# EasyEDA Pro project Dual_Motor_Driver_V3.1.eprj, schematic Motor_Driver
Create Date: 2025-08-30; Page Name: P1; Project Name: Dual_Motor_Driver_V3.1; Schematic Name: Motor_Driver; Update Date: 2025-08-30; Company: 嘉立创EDA; Page Size: A4; Version: V1.0
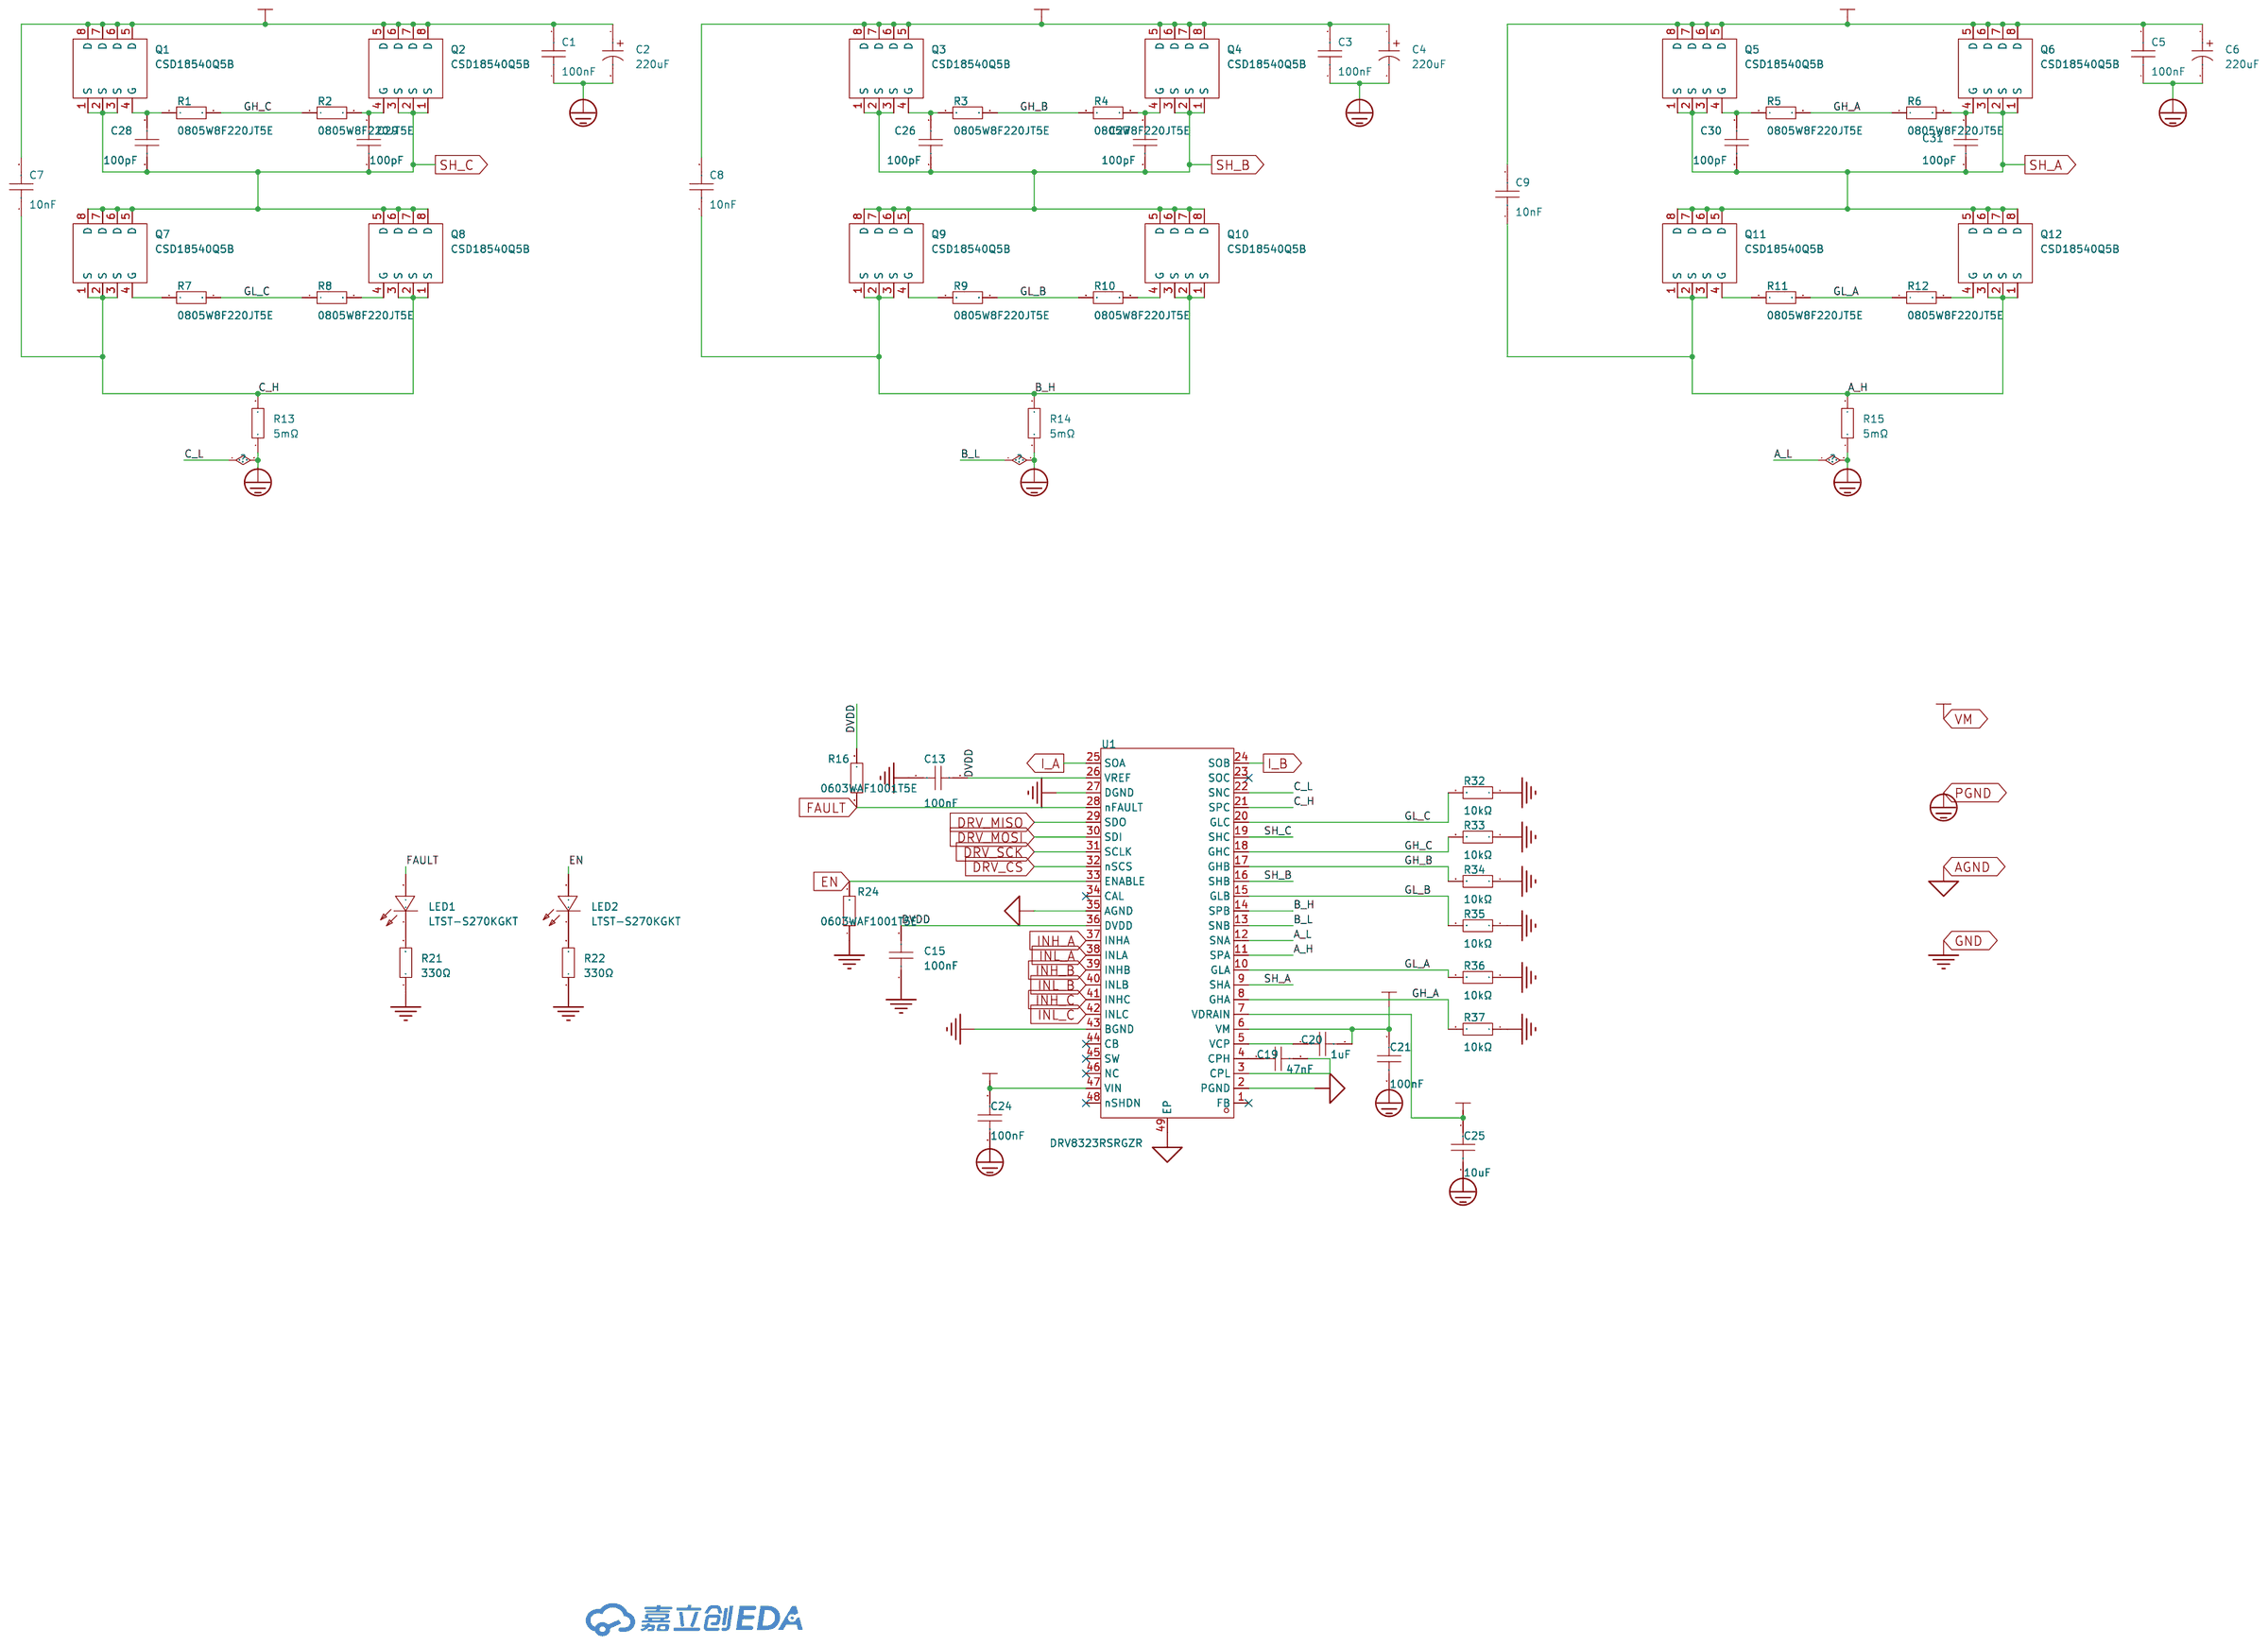
[diagram p0: schematic sheet]

## Parts
C1  100nF  [C1206]
C2  220uF  [CAP-SMD_BD12.5-L13.5-W13.5-FD-1]
C3  100nF  [C1206]
C4  220uF  [CAP-SMD_BD12.5-L13.5-W13.5-FD-1]
C5  100nF  [C1206]
C6  220uF  [CAP-SMD_BD12.5-L13.5-W13.5-FD-1]
C7  10nF  [C1206]
C8  10nF  [C1206]
C9  10nF  [C1206]
C13  100nF  [C0603]
C15  100nF  [C0603]
C19  47nF  [C0603]
C20  1uF  [C0805]
C21  100nF  [C0805]
C24  100nF  [C0805]
C25  10uF  [C0805]
C26  100pF  [C0603]
C27  100pF  [C0603]
C28  100pF  [C0603]
C29  100pF  [C0603]
C30  100pF  [C0603]
C31  100pF  [C0603]
LED1  LTST-S270KGKT  [LED-SMD_L1.7-W0.6-RD]
LED2  LTST-S270KGKT  [LED-SMD_L1.7-W0.6-RD]
Q1  CSD18540Q5B  [VSON-CLIP-8_L5.0-W6.0-P1.27-BL]
Q2  CSD18540Q5B  [VSON-CLIP-8_L5.0-W6.0-P1.27-BL]
Q3  CSD18540Q5B  [VSON-CLIP-8_L5.0-W6.0-P1.27-BL]
Q4  CSD18540Q5B  [VSON-CLIP-8_L5.0-W6.0-P1.27-BL]
Q5  CSD18540Q5B  [VSON-CLIP-8_L5.0-W6.0-P1.27-BL]
Q6  CSD18540Q5B  [VSON-CLIP-8_L5.0-W6.0-P1.27-BL]
Q7  CSD18540Q5B  [VSON-CLIP-8_L5.0-W6.0-P1.27-BL]
Q8  CSD18540Q5B  [VSON-CLIP-8_L5.0-W6.0-P1.27-BL]
Q9  CSD18540Q5B  [VSON-CLIP-8_L5.0-W6.0-P1.27-BL]
Q10  CSD18540Q5B  [VSON-CLIP-8_L5.0-W6.0-P1.27-BL]
Q11  CSD18540Q5B  [VSON-CLIP-8_L5.0-W6.0-P1.27-BL]
Q12  CSD18540Q5B  [VSON-CLIP-8_L5.0-W6.0-P1.27-BL]
R1  0805W8F220JT5E  [R0805]
R2  0805W8F220JT5E  [R0805]
R3  0805W8F220JT5E  [R0805]
R4  0805W8F220JT5E  [R0805]
R5  0805W8F220JT5E  [R0805]
R6  0805W8F220JT5E  [R0805]
R7  0805W8F220JT5E  [R0805]
R8  0805W8F220JT5E  [R0805]
R9  0805W8F220JT5E  [R0805]
R10  0805W8F220JT5E  [R0805]
R11  0805W8F220JT5E  [R0805]
R12  0805W8F220JT5E  [R0805]
R13  5mΩ  [R2512]
R14  5mΩ  [R2512]
R15  5mΩ  [R2512]
R16  0603WAF1001T5E  [R0603]
R21  330Ω  [R0603]
R22  330Ω  [R0603]
R24  0603WAF1001T5E  [R0603]
R32  10kΩ  [R0805]
R33  10kΩ  [R0805]
R34  10kΩ  [R0805]
R35  10kΩ  [R0805]
R36  10kΩ  [R0805]
R37  10kΩ  [R0805]
U1  DRV8323RSRGZR  [VQFN-48_L7.0-W7.0-P0.50-TL-EP5.1]

## Library data of the parts
C1 C3 C5 = CL31B104KBCNNNC: 容值:100nF;精度:±10%;额定电压:50V;材质(温度系数):X7R;; LCSC Part Name: 100nF ±10% 50V; Supplier Part: C24497; Manufacturer: SAMSUNG(三星); Supplier Footprint: 1206; JLCPCB Part Class: Basic Part; Datasheet: https://atta.szlcsc.com/upload/public/pdf/source/20160218/1457707763339.pdf; Supplier: LCSC; Tolerance: ±10%; Voltage Rated: 50V; Temperature Coefficient: X7R
C2 C4 C6 = VMML1652A221MV: 容值:220uF;精度:±20%;额定电压:100V;纹波电流:-;等效串联电阻:-;; LCSC Part Name: 220uF ±20% 100V; Supplier Part: C487184; Manufacturer: Ymin(永铭); Supplier Footprint: SMD,D12.5xL16.5mm; JLCPCB Part Class: Extended Part; Datasheet: https://atta.szlcsc.com/upload/public/pdf/source/20200220/C487283_B2B02AE81BD8A6F1FEC0F15CA59E8094.pdf; Supplier: LCSC; Tolerance: ±20%; Rated Voltage: 100V
C7-C9 = CC1206KRX7R0BB103: 容值:10nF;精度:±10%;额定电压:100V;材质(温度系数):X7R;; LCSC Part Name: 10nF ±10% 100V; Supplier Part: C107204; Manufacturer: YAGEO(国巨); Supplier Footprint: 1206; JLCPCB Part Class: Extended Part; Datasheet: https://atta.szlcsc.com/upload/public/pdf/source/20210913/C2412925_D4333A006ECFD3D34C89070D645063F7.pdf; Supplier: LCSC; Tolerance: ±10%; Voltage Rated: 100V; Temperature Coefficient: X7R
C13 C15 = CL10B104KC8NNNC: 容值:100nF;精度:±10%;额定电压:100V;材质(温度系数):X7R;; LCSC Part Name: 100nF ±10% 100V; Supplier Part: C15725; Manufacturer: SAMSUNG(三星); Supplier Footprint: 0603; JLCPCB Part Class: Extended Part; Datasheet: https://atta.szlcsc.com/upload/public/pdf/source/20160218/1457707763339.pdf; Supplier: LCSC; Tolerance: ±10%; Voltage Rated: 100V; Temperature Coefficient: X7R
C19 = AC0603KRX7R0BB473: 容值:47nF;精度:±10%;额定电压:100V;材质(温度系数):X7R;; LCSC Part Name: 47nF ±10% 100V; Supplier Part: C469624; Manufacturer: YAGEO(国巨); Supplier Footprint: 0603; JLCPCB Part Class: Extended Part; Datasheet: https://atta.szlcsc.com/upload/public/pdf/source/20191217/C469624_84C34F492B76C2BCBA39E88472E4BE3D.pdf; Supplier: LCSC; Tolerance: ±10%; Voltage Rated: 100V; Temperature Coefficient: X7R
C20 = GCM21BC72A105KE36L: 容值:1uF;精度:±10%;额定电压:100V;材质(温度系数):X7S;; LCSC Part Name: 1uF ±10% 100V; Supplier Part: C126585; Manufacturer: muRata(村田); Supplier Footprint: 0805; JLCPCB Part Class: Extended Part; Datasheet: https://atta.szlcsc.com/upload/public/pdf/source/20170912/C126585_1505207917043963682.pdf; Supplier: LCSC; Tolerance: ±10%; Voltage Rated: 100V; Temperature Coefficient: X7S
C21 = CL21B104KCFNNNE: 容值:100nF;精度:±10%;额定电压:100V;材质(温度系数):X7R;; LCSC Part Name: 100nF ±10% 100V; Supplier Part: C28233; Manufacturer: SAMSUNG(三星); Supplier Footprint: 0805; JLCPCB Part Class: Basic Part; Datasheet: https://atta.szlcsc.com/upload/public/pdf/source/20160218/1457707763339.pdf; Supplier: LCSC; Tolerance: ±10%; Voltage Rated: 100V; Temperature Coefficient: X7R
C24 = GCM21BR72A104KA37L: 容值:100nF;精度:±10%;额定电压:100V;材质(温度系数):X7R;; LCSC Part Name: 100nF ±10% 100V; Supplier Part: C85866; Manufacturer: muRata(村田); Supplier Footprint: 0805; JLCPCB Part Class: Extended Part; Datasheet: https://atta.szlcsc.com/upload/public/pdf/source/20161104/1478252919844.pdf; Supplier: LCSC; Tolerance: ±10%; Voltage Rated: 100V; Temperature Coefficient: X7R
C25 = CL21A106KAYNNNE_C15850: 容值:10uF;精度:±10%;额定电压:25V;材质(温度系数):X5R;; LCSC Part Name: 10uF ±10% 25V; Supplier Part: C15850; Manufacturer: SAMSUNG(三星); Manufacturer Part: CL21A106KAYNNNE; Supplier Footprint: 0805; JLCPCB Part Class: Basic Part; Datasheet: https://atta.szlcsc.com/upload/public/pdf/source/20160103/1457707679302.pdf; Supplier: LCSC; Tolerance: ±10%; Voltage Rated: 25V; Temperature Coefficient: X5R
C26-C31 = CL10C101JB8NNNC: 容值:100pF;精度:±5%;额定电压:50V;材质(温度系数):C0G;; LCSC Part Name: 100pF ±5% 50V; Supplier Part: C14858; Manufacturer: SAMSUNG(三星); Supplier Footprint: 0603; JLCPCB Part Class: Basic Part; Datasheet: https://atta.szlcsc.com/upload/public/pdf/source/20160103/1457707672333.pdf; Supplier: LCSC; Tolerance: ±5%; Voltage Rated: 50V; Temperature Coefficient: C0G
LED1 LED2 = LTST-S270KGKT: 发光颜色:黄绿色;功率:75mW;正向电流:20mA;主波长:571nm;二极管配置:-;透镜颜色:无色透明透镜;色温:-;发光角度:130°;载带方式:侧贴;工作温度:-30℃~+85℃;; LCSC Part Name: 普绿/黄绿 侧贴; Supplier Part: C125113; Manufacturer: LITEON(光宝); Supplier Footprint: SMD,1.2x1.6mm; JLCPCB Part Class: 扩展库; Datasheet: https://atta.szlcsc.com/upload/public/pdf/source/20180104/C125113_15150602232371230485.pdf; Supplier: LCSC; Emitted Color: 黄绿色; Power Dissipation: 75mW; Forward Current: 20mA; Dominant Wavelength: 571nm; Peak Wavelength: 574nm; Lens Color: 无色透明透镜; Viewing Angle: 130°; Mounting Sytle: 侧贴; Operating Temperature: -30℃~+85℃
Q1-Q12 = CSD18540Q5B: 类型:1个N沟道;漏源电压(Vdss):60V;连续漏极电流(Id):205A;导通电阻(RDS(on)@Vgs,Id):2.6mΩ@10V,28A;功率(Pd):3.8W;阈值电压(Vgs(th)@Id):1.9V@250uA;; LCSC Part Name: 1个N沟道 耐压:60V 电流:205A; Supplier Part: C86513; Manufacturer: TI(德州仪器); Supplier Footprint: VSON-8(5x6); JLCPCB Part Class: 扩展库; Datasheet: https://www.ti.com/lit/ds/symlink/csd18540q5b.pdf?ts=1718590350466&ref_url=https%253A%252F%252Fwww.ti.com.cn%252Fproduct%252Fzh-cn%252FCSD18540Q5B%253FkeyMatch%253DCSD18540Q5B%2526tisearch%253Dsearch-everything%2526usecase%253DOPN; Supplier: LCSC; Type: 1个N沟道; Drain Source Voltage (Vdss): 60V; Continuous Drain Current (Id): 205A; Drain Source On Resistance (RDS(on)@Vgs,Id): 2.6mΩ@10V,28A; Power Dissipation (Pd): 3.8W; Gate Threshold Voltage (Vgs(th)@Id): 1.9V@250uA; Total Gate Charge (Qg@Vgs): 41nC@10V; Input Capacitance (Ciss@Vds): 4.23nF@30V; Reverse Transfer Capacitance (Crss@Vds): 20pF@30V; Operating Temperature: -55℃~+175℃
R1-R12 = 0805W8F220JT5E: LCSC Part Name: 22Ω(22R0) ±1% 编带; Supplier Part: C17561; Manufacturer: UNI-ROYAL(厚声); Supplier Footprint: 0805; JLCPCB Part Class: Basic Part; Datasheet: https://atta.szlcsc.com/upload/public/pdf/source/20170920/C17561_1505887138086979919.pdf; Supplier: LCSC
R13-R15 = HoYLR2512-2W-5mR-1%: 电阻类型:采样电阻;阻值:5mΩ;精度:±1%;功率:2W;安装方式:贴片;; LCSC Part Name: 5mΩ ±1% 2W; Supplier Part: C5375417; Manufacturer: Milliohm(毫欧); Supplier Footprint: 2512; JLCPCB Part Class: Extended Part; Datasheet: https://atta.szlcsc.com/upload/public/pdf/source/20230506/030C75DA7C4694D1A0A3C5A1E352E2F2.pdf; Supplier: LCSC; Type: 采样电阻; Tolerance: ±1%; Power(Watts): 2W; Mounting Sytle: 贴片
R16 R24 = 0603WAF1001T5E: LCSC Part Name: 1KΩ(1001) ±1% 编带; Supplier Part: C21190; Manufacturer: UNI-ROYAL(厚声); Supplier Footprint: 0603; JLCPCB Part Class: Basic Part; Datasheet: https://atta.szlcsc.com/upload/public/pdf/source/20170920/C21190_1505887441885980538.pdf; Supplier: LCSC
R21 R22 = 0603WAF3300T5E: 电阻类型:厚膜电阻;阻值:330Ω;精度:±1%;功率:100mW;最大工作电压:75V;温度系数:±100ppm/℃;; LCSC Part Name: 330Ω ±1% 100mW 厚膜电阻; Supplier Part: C23138; Manufacturer: UNI-ROYAL(厚声); Supplier Footprint: 0603; JLCPCB Part Class: Basic Part; Datasheet: https://atta.szlcsc.com/upload/public/pdf/source/20200306/C422600_1E6D84923E4A46A82E41ADD87F860B5C.pdf; Supplier: LCSC; Type: 厚膜电阻; Tolerance: ±1%; Power(Watts): 100mW; Overload Voltage (Max): 75V; Temperature Coefficient: ±100ppm/℃; Operating Temperature Range: -55℃~+155℃
R32-R37 = 0805W8F1002T5E_C17414: 电阻类型:厚膜电阻;阻值:10kΩ;精度:±1%;功率:125mW;最大工作电压:150V;温度系数:±100ppm/℃;; LCSC Part Name: 10kΩ ±1% 125mW 厚膜电阻; Supplier Part: C17414; Manufacturer: UNI-ROYAL(厚声); Manufacturer Part: 0805W8F1002T5E; Supplier Footprint: 0805; JLCPCB Part Class: Basic Part; Datasheet: https://atta.szlcsc.com/upload/public/pdf/source/20200306/C422600_1E6D84923E4A46A82E41ADD87F860B5C.pdf; Supplier: LCSC; Type: 厚膜电阻; Tolerance: ±1%; Power(Watts): 125mW; Overload Voltage (Max): 150V; Temperature Coefficient: ±100ppm/℃; Operating Temperature Range: -55℃~+155℃
U1 = DRV8323RSRGZR: DRV8323R 具有降压稳压器和电流分流放大器的最大 65V 三相智能栅极驱动器; LCSC Part Name: 5mA 无刷直流BLDC电机驱动芯片 60V; Supplier Part: C545497; Manufacturer: TI(德州仪器); Supplier Footprint: VQFN-48-EP(7x7); JLCPCB Part Class: 扩展库; Datasheet: https://www.ti.com/cn/lit/gpn/drv8323r; Supplier: LCSC

## Nets
AGND: U1.2(PGND) U1.35(AGND) U1.49(EP)
DVDD: C13.2 C15.2 R16.2 U1.26(VREF) U1.36(DVDD)
GND: C13.1 C15.1 R21.1 R22.1 R24.1 R32.1 R33.1 R34.1 R35.1 R36.1 R37.1 U1.27(DGND) U1.43(BGND)
PGND: C1.1 C2.2 C3.1 C4.2 C5.1 C6.2 C21.2 C24.2 C25.2 R13.1 R14.1 R15.1 U1.12(SNA) U1.13(SNB) U1.22(SNC)
A_H: C9.1 Q11.1(S) Q11.2(S) Q11.3(S) Q12.1(S) Q12.2(S) Q12.3(S) R15.2 U1.11(SPA)
B_H: C8.1 Q9.1(S) Q9.2(S) Q9.3(S) Q10.1(S) Q10.2(S) Q10.3(S) R14.2 U1.14(SPB)
C_H: C7.1 Q7.1(S) Q7.2(S) Q7.3(S) Q8.1(S) Q8.2(S) Q8.3(S) R13.2 U1.21(SPC)
DRV_CS: U1.32(nSCS)
DRV_MISO: U1.29(SDO)
DRV_MOSI: U1.30(SDI)
DRV_SCK: U1.31(SCLK)
EN: LED2.2(A) R24.2 U1.33(ENABLE)
FAULT: LED1.2(A) R16.1 U1.28(nFAULT)
GH_A: R5.2 R6.1 R37.2 U1.8(GHA)
GH_B: R3.2 R4.1 R34.2 U1.17(GHB)
GH_C: R1.2 R2.1 R33.2 U1.18(GHC)
GL_A: R11.2 R12.1 R36.2 U1.10(GLA)
GL_B: R9.2 R10.1 R35.2 U1.15(GLB)
GL_C: R7.2 R8.1 R32.2 U1.20(GLC)
I_A: U1.25(SOA)
I_B: U1.24(SOB)
INH_A: U1.37(INHA)
INH_B: U1.39(INHB)
INH_C: U1.41(INHC)
INL_A: U1.38(INLA)
INL_B: U1.40(INLB)
INL_C: U1.42(INLC)
SH_A: C30.1 C31.1 Q5.1(S) Q5.2(S) Q5.3(S) Q6.1(S) Q6.2(S) Q6.3(S) Q11.5(D) Q11.6(D) Q11.7(D) Q11.8(D) Q12.5(D) Q12.6(D) Q12.7(D) Q12.8(D) U1.9(SHA)
SH_B: C26.1 C27.1 Q3.1(S) Q3.2(S) Q3.3(S) Q4.1(S) Q4.2(S) Q4.3(S) Q9.5(D) Q9.6(D) Q9.7(D) Q9.8(D) Q10.5(D) Q10.6(D) Q10.7(D) Q10.8(D) U1.16(SHB)
SH_C: C28.1 C29.1 Q1.1(S) Q1.2(S) Q1.3(S) Q2.1(S) Q2.2(S) Q2.3(S) Q7.5(D) Q7.6(D) Q7.7(D) Q7.8(D) Q8.5(D) Q8.6(D) Q8.7(D) Q8.8(D) U1.19(SHC)
VM: C1.2 C2.1 C3.2 C4.1 C5.2 C6.1 C7.2 C8.2 C9.2 C20.2 C21.1 C24.1 C25.1 Q1.5(D) Q1.6(D) Q1.7(D) Q1.8(D) Q2.5(D) Q2.6(D) Q2.7(D) Q2.8(D) Q3.5(D) Q3.6(D) Q3.7(D) Q3.8(D) Q4.5(D) Q4.6(D) Q4.7(D) Q4.8(D) Q5.5(D) Q5.6(D) Q5.7(D) Q5.8(D) Q6.5(D) Q6.6(D) Q6.7(D) Q6.8(D) U1.6(VM) U1.7(VDRAIN) U1.47(VIN)
Net-(C19-1): C19.1 U1.4(CPH)
Net-(C19-2): C19.2 U1.3(CPL)
Net-(C20-1): C20.1 U1.5(VCP)
Net-(C26-2): C26.2 Q3.4(G) R3.1
Net-(C27-2): C27.2 Q4.4(G) R4.2
Net-(C28-2): C28.2 Q1.4(G) R1.1
Net-(C29-2): C29.2 Q2.4(G) R2.2
Net-(C30-2): C30.2 Q5.4(G) R5.1
Net-(C31-2): C31.2 Q6.4(G) R6.2
Net-(LED1-1): LED1.1(K) R21.2
Net-(LED2-1): LED2.1(K) R22.2
Net-(Q7-4): Q7.4(G) R7.1
Net-(Q8-4): Q8.4(G) R8.2
Net-(Q9-4): Q9.4(G) R9.1
Net-(Q10-4): Q10.4(G) R10.2
Net-(Q11-4): Q11.4(G) R11.1
Net-(Q12-4): Q12.4(G) R12.2

Not connected (* = marked no-connect by the designer): U1 1(FB)* 23(SOC)* 34(CAL)* 44(CB)* 45(SW)* 46(NC)* 48(nSHDN)*
